# Altium schematic sheet Gastroscopy-СutController_Title.SchDoc: not used
size 215 x 279 mm; PageSetup: Record=PageOptions|CenterHorizontal=True|CenterVertical=True|PrintScale=0.94|XCorrection=1.00|YCorrection=1.00|PrintKind=0|BorderSize=5000000|LeftOffset=0|BottomOffset=0|Orientation=2|PaperLength=1000|PaperWidth=1000|Scale=100|PaperSource=15|PrintQuality=600|MediaType=1|DitherType=10|PrintScaleMode=1|PaperKind=Letter|PaperIndex=1; VersionControl_RevNumber: not used; IsUserConfigurable: not used; Date: not used; ApprovedBy: not used; CheckedBy: not used; Author: not used; DrawnBy: not used; Engineer: not used; Organization: not used; Address1: not used; Address2: not used; Address3: not used; Address4: not used; Revision: not used; SheetNumber: 7; SheetTotal: 8; Time: not used; ImagePath: not used; Application_BuildNumber: not used
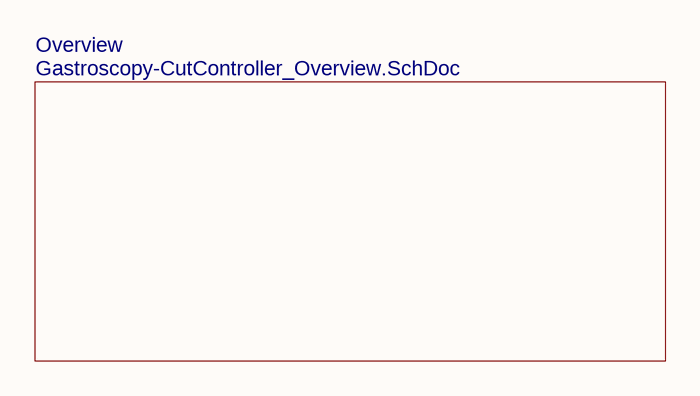
[diagram p0: Gastroscopy-СutController_Title.SchDoc]

## Sub-sheets
Overview = Gastroscopy-CutController_Overview.SchDoc: no entries

## Notes on the sheet
- Company:
- Project:
- Jira Key: